# Altium schematic sheet CPU.SchDoc
size A4; PageSetup: Record=PageOptions|CenterHorizontal=True|CenterVertical=True|PrintScale=0.95|XCorrection=1.00|YCorrection=1.00|PrintKind=1|BorderSize=5000000|LeftOffset=0|BottomOffset=0|Orientation=2|PaperLength=1000|PaperWidth=1000|Scale=100|PaperSource=7|PrintQuality=-4|MediaType=1|DitherType=10|PaperKind=A4, 210x297 mm|PrintScaleMode=1
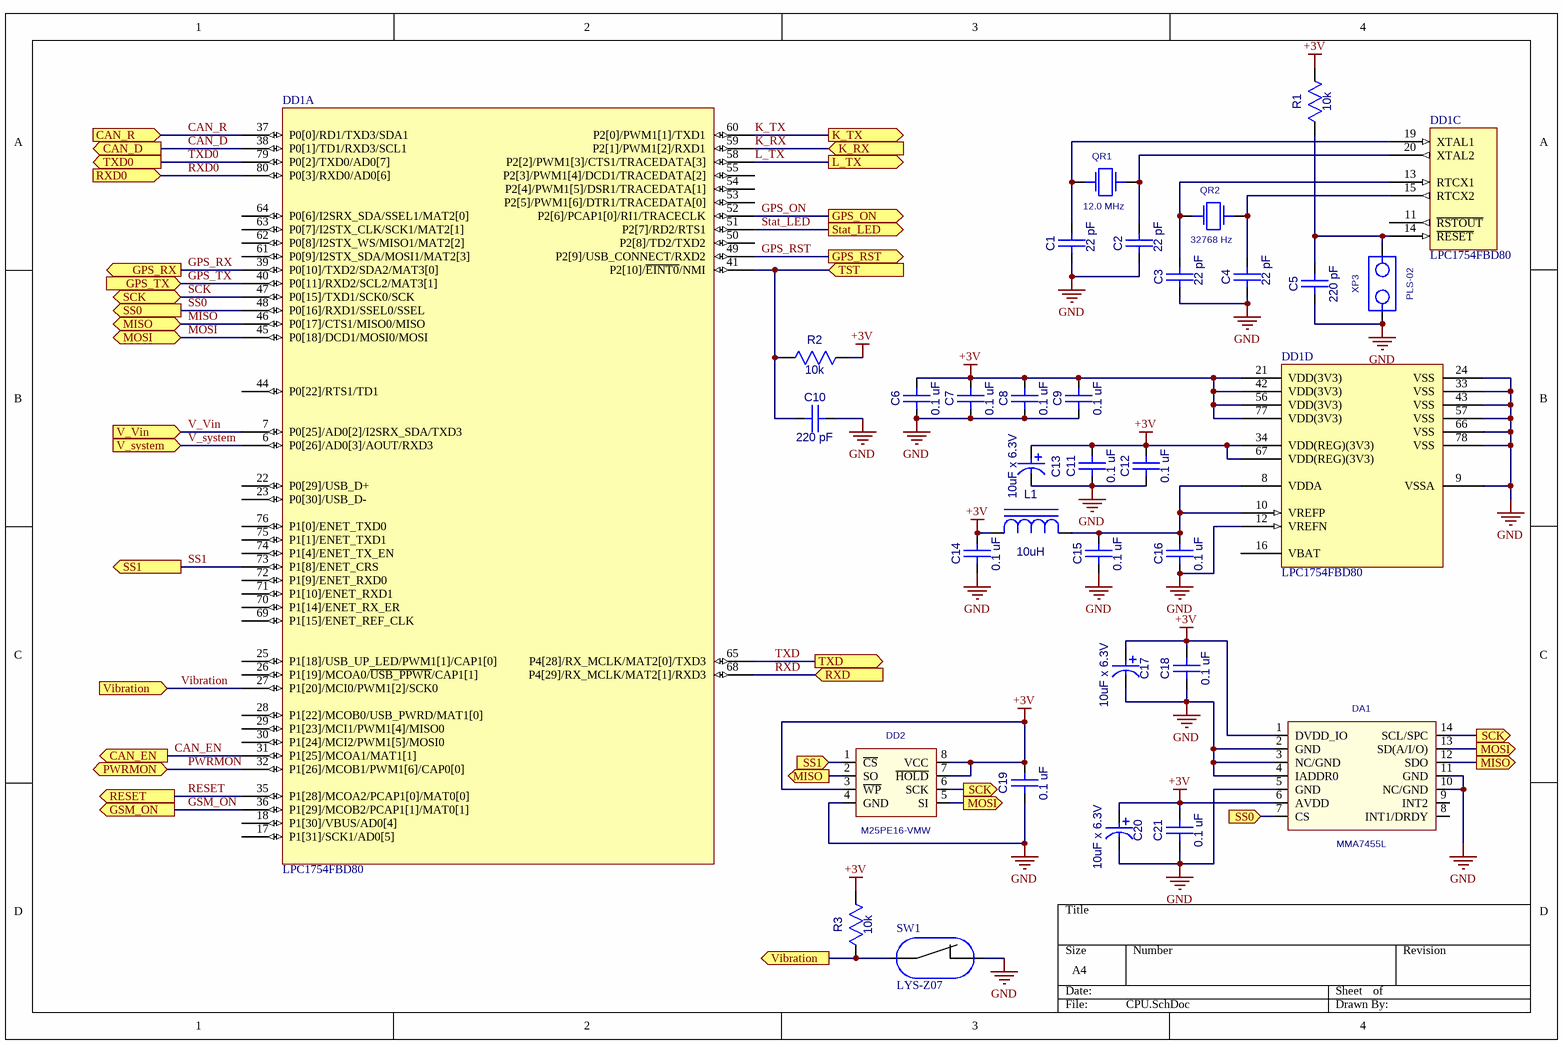
[diagram p0: CPU.SchDoc]

## Parts
C1  22 pF  [CC0603-3M]
C2  22 pF  [CC0603-3M]
C3  22 pF  [CC0603-3M]
C4  22 pF  [CC0603-3M]
C5  220 pF  [CC0603-3M]
C6  0.1 uF  [CC0603-3M]
C7  0.1 uF  [CC0603-3M]
C8  0.1 uF  [CC0603-3M]
C9  0.1 uF  [CC0603-3M]
C10  220 pF  [CC0603-3M]
C11  0.1 uF  [CC0603-3M]
C12  0.1 uF  [CC0603-3M]
C13  10uF x 6.3V  [TAJ-A_M]
C14  0.1 uF  [CC0603-3M]
C15  0.1 uF  [CC0603-3M]
C16  0.1 uF  [CC0603-3M]
C17  10uF x 6.3V  [TAJ-A_M]
C18  0.1 uF  [CC0603-3M]
C19  0.1 uF  [CC0603-3M]
C20  10uF x 6.3V  [TAJ-A_M]
C21  0.1 uF  [CC0603-3M]
DA1  MMA7455L  [LGA-14]
DD1  LPC1754FBD80  [TQFP-80_0.5]  (parts A,C,D of 4)
DD2  M25PE16-VMW  [EIAJ_SO8]
L1  10uH  [L0603]
QR1  12.0 MHz  [AC5032_2]
QR2  32768 Hz  [QR_32768]
R1  10k  [RC0603-3M]
R2  10k  [RC0603-3M]
R3  10k  [RC0603-3M]
SW1  LYS-Z07  [LYS-Z07]
XP3  PLS-02  [PIN2W]

## Ports
CAN_D (out), CAN_EN (out), CAN_R (in), GPS_ON (out), GPS_RST (out), GPS_RX (out), GPS_TX (in), GSM_ON (out), K_RX (in), K_TX (out), L_TX (out), MISO, MOSI, PWRMON, RESET (out), RXD0 (in), RXD (in), SCK, SS0 (in), SS0 (out), SS1 (in), SS1 (out), Stat_LED (out), TST (in), TXD0 (out), TXD (out), V_system (in), V_Vin (in), Vibration (in), Vibration (out)

## Nets
+3V: C6.2(B) C7.2(B) C8.2(B) C9.2(B) C11.2(B) C12.2(B) C13.1(A) C14.2(B) C17.1(A) C18.2(B) C19.2(B) C20.1(A) C21.2(B) DA1.1(DVDD_IO) DA1.6(AVDD) DD1.21(VDD(3V3)) DD1.34(VDD(REG)(3V3)) DD1.42(VDD(3V3)) DD1.56(VDD(3V3)) DD1.67(VDD(REG)(3V3)) DD1.77(VDD(3V3)) DD2.3(~{WP}) DD2.7(~{HOLD}) DD2.8(VCC) L1.1(A) R1.2(B) R2.2(B) R3.2(B)
GND: C1.1(A) C2.1(A) C3.1(A) C4.1(A) C5.1(A) C6.1(A) C7.1(A) C8.1(A) C9.1(A) C10.2(B) C11.1(A) C12.1(A) C13.2(B) C14.1(A) C15.1(A) C16.1(A) C17.2(B) C18.1(A) C19.1(A) C20.2(B) C21.1(A) DA1.2(GND) DA1.3(NC/GND) DA1.4(IADDR0) DA1.5(GND) DA1.10(NC/GND) DA1.11(GND) DD1.9(VSSA) DD1.12(VREFN) DD1.24(VSS) DD1.33(VSS) DD1.43(VSS) DD1.57(VSS) DD1.66(VSS) DD1.78(VSS) DD2.4(GND) SW1.2 XP3.1
CAN_D: DD1.38(P0[1]/TD1/RXD3/SCL1) ; port CAN_D
CAN_EN: DD1.31(P1[25]/MCOA1/MAT1[1]) ; port CAN_EN
CAN_R: DD1.37(P0[0]/RD1/TXD3/SDA1) ; port CAN_R
GPS_ON: DD1.52(P2[6]/PCAP1[0]/RI1/TRACECLK) ; port GPS_ON
GPS_RST: DD1.49(P2[9]/USB_CONNECT/RXD2) ; port GPS_RST
GPS_RX: DD1.39(P0[10]/TXD2/SDA2/MAT3[0]) ; port GPS_RX
GPS_TX: DD1.40(P0[11]/RXD2/SCL2/MAT3[1]) ; port GPS_TX
GSM_ON: DD1.36(P1[29]/MCOB2/PCAP1[1]/MAT0[1]) ; port GSM_ON
K_RX: DD1.59(P2[1]/PWM1[2]/RXD1) ; port K_RX
K_TX: DD1.60(P2[0]/PWM1[1]/TXD1) ; port K_TX
L_TX: DD1.58(P2[2]/PWM1[3]/CTS1/TRACEDATA[3]) ; port L_TX
MISO: DA1.12(SDO) DD1.46(P0[17]/CTS1/MISO0/MISO) DD2.2(SO) ; port MISO
MOSI: DA1.13(SD(A/I/O)) DD1.45(P0[18]/DCD1/MOSI0/MOSI) DD2.5(SI) ; port MOSI
PWRMON: DD1.32(P1[26]/MCOB1/PWM1[6]/CAP0[0]) ; port PWRMON
RESET: DD1.35(P1[28]/MCOA2/PCAP1[0]/MAT0[0]) ; port RESET
RXD: DD1.68(P4[29]/RX_MCLK/MAT2[1]/RXD3) ; port RXD
RXD0: DD1.80(P0[3]/RXD0/AD0[6]) ; port RXD0
SCK: DA1.14(SCL/SPC) DD1.47(P0[15]/TXD1/SCK0/SCK) DD2.6(SCK) ; port SCK
SS0: DA1.7(CS) DD1.48(P0[16]/RXD1/SSEL0/SSEL) ; port SS0
SS1: DD1.73(P1[8]/ENET_CRS) DD2.1(~{CS}) ; port SS1
Stat_LED: DD1.51(P2[7]/RD2/RTS1) ; port Stat_LED
TST: C10.1(A) DD1.41(P2[10]/~{EINT0}/NMI) R2.1(A) ; port TST
TXD: DD1.65(P4[28]/RX_MCLK/MAT2[0]/TXD3) ; port TXD
TXD0: DD1.79(P0[2]/TXD0/AD0[7]) ; port TXD0
V_system: DD1.6(P0[26]/AD0[3]/AOUT/RXD3) ; port V_system
V_Vin: DD1.7(P0[25]/AD0[2]/I2SRX_SDA/TXD3) ; port V_Vin
Vibration: DD1.27(P1[20]/MCI0/PWM1[2]/SCK0) R3.1(A) SW1.1 ; port Vibration
NetC1_2: C1.2(B) DD1.19(XTAL1) QR1.1
NetC2_2: C2.2(B) DD1.20(XTAL2) QR1.2
NetC3_2: C3.2(B) DD1.13(RTCX1) QR2.1(X1)
NetC4_2: C4.2(B) DD1.15(RTCX2) QR2.2(X2)
NetC5_2: C5.2(B) DD1.14(~{RESET}) R1.1(A) XP3.2
NetC15_2: C15.2(B) C16.2(B) DD1.8(VDDA) DD1.10(VREFP) L1.2(C)

Not connected (* = marked no-connect by the designer): DA1 8(INT1/DRDY) 9(INT2); DD1 11(~{RSTOUT}) 16(VBAT) 17(P1[31]/SCK1/AD0[5]) 18(P1[30]/VBUS/AD0[4]) 22(P0[29]/USB_D+) 23(P0[30]/USB_D-) 25(P1[18]/USB_UP_LED/PWM1[1]/CAP1[0]) 26(P1[19]/MCOA0/~{USB_PPWR}/CAP1[1]) 28(P1[22]/MCOB0/USB_PWRD/MAT1[0]) 29(P1[23]/MCI1/PWM1[4]/MISO0) 30(P1[24]/MCI2/PWM1[5]/MOSI0) 44(P0[22]/RTS1/TD1) 50(P2[8]/TD2/TXD2) 53(P2[5]/PWM1[6]/DTR1/TRACEDATA[0]) 54(P2[4]/PWM1[5]/DSR1/TRACEDATA[1]) 55(P2[3]/PWM1[4]/DCD1/TRACEDATA[2]) 61(P0[9]/I2STX_SDA/MOSI1/MAT2[3]) 62(P0[8]/I2STX_WS/MISO1/MAT2[2]) 63(P0[7]/I2STX_CLK/SCK1/MAT2[1]) 64(P0[6]/I2SRX_SDA/SSEL1/MAT2[0]) 69(P1[15]/ENET_REF_CLK) 70(P1[14]/ENET_RX_ER) 71(P1[10]/ENET_RXD1) 72(P1[9]/ENET_RXD0) 74(P1[4]/ENET_TX_EN) 75(P1[1]/ENET_TXD1) 76(P1[0]/ENET_TXD0)

## Library data of the parts
C1-C12 C14-C16 C18 C19 C21 = CC0603
  C1-C4: Value: 22 pF
  C5 C10: Value: 220 pF
  C6-C9 C11 C12 C14-C16 C18 C19 C21: Value: 0.1 uF
C13 C17 C20 = TAJ-A: Value: 10uF x 6.3V
DD1 = LPC1754FBD80: Cortex -M3 32-Bit Microcontroller, 128KB Flash, 64KB RAM, 800-Lead LQFP; ComponentLink1Description: Manufacturer Link; ComponentLink1URL: http://www.nxp.com/
DD2 = S25FL016A0LMFI01: Value: M25PE16-VMW
L1 = L0603: Value: 10uH
QR1 = AC5032_2: AC5032/2; Value: 12.0 MHz
QR2 = CRYSTAL_32768: CRYSTAL_32768 Hz; Value: 32768 Hz
R1-R3 = RC0603: Value: 10k
SW1 = LYS-Z07: NC vibration sensor
XP3 = PLD-02: Value: *
DA1 = MMA7455L: Value: *